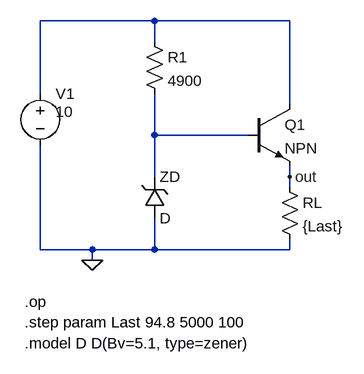
[diagram p0: schematic test_measures.asc]
test_measures.asc, the LTspice schematic file:
Version 4
SHEET 1 920 680
WIRE 32 -1120 -144 -1120
WIRE 240 -1120 32 -1120
WIRE 32 -1088 32 -1120
WIRE -144 -1008 -144 -1120
WIRE 240 -992 240 -1120
WIRE 32 -944 32 -1008
WIRE 176 -944 32 -944
WIRE 32 -880 32 -944
WIRE 240 -880 240 -896
WIRE 240 -864 240 -880
WIRE -144 -768 -144 -928
WIRE -64 -768 -144 -768
WIRE 32 -768 32 -816
WIRE 32 -768 -64 -768
WIRE 240 -768 240 -784
WIRE 240 -768 32 -768
WIRE -64 -752 -64 -768
FLAG -64 -752 0
FLAG 240 -880 out
SYMBOL zener 16 -816 M180
WINDOW 0 24 64 Left 2
WINDOW 3 24 0 Left 2
SYMATTR InstName ZD
SYMBOL res 16 -1104 R0
SYMATTR InstName R1
SYMATTR Value 4900
SYMBOL npn 176 -992 R0
SYMATTR InstName Q1
SYMBOL res 224 -880 R0
SYMATTR InstName RL
SYMATTR Value {Last}
SYMBOL voltage -144 -1024 R0
WINDOW 3 24 44 Left 2
WINDOW 123 0 0 Left 0
WINDOW 39 0 0 Left 0
SYMATTR Value 10
SYMATTR InstName V1
TEXT -168 -688 Left 2 !.op
TEXT -168 -656 Left 2 !.step param Last 94.8 5000 100
TEXT -168 -624 Left 2 !.model D D(Bv=5.1, type=zener)

The netlist it stands for:
* test_measures.asc
D§ZD 0 N002 D
R1 N001 N002 4900
Q1 N001 N002 out 0 NPN
RL out 0 {Last}
V1 N001 0 10
.model D D
.lib standard.dio
.model NPN NPN
.model PNP PNP
.lib standard.bjt
.op
.step param Last 94.8 5000 100
.model D D(Bv=5.1, type=zener)
.backanno
.end